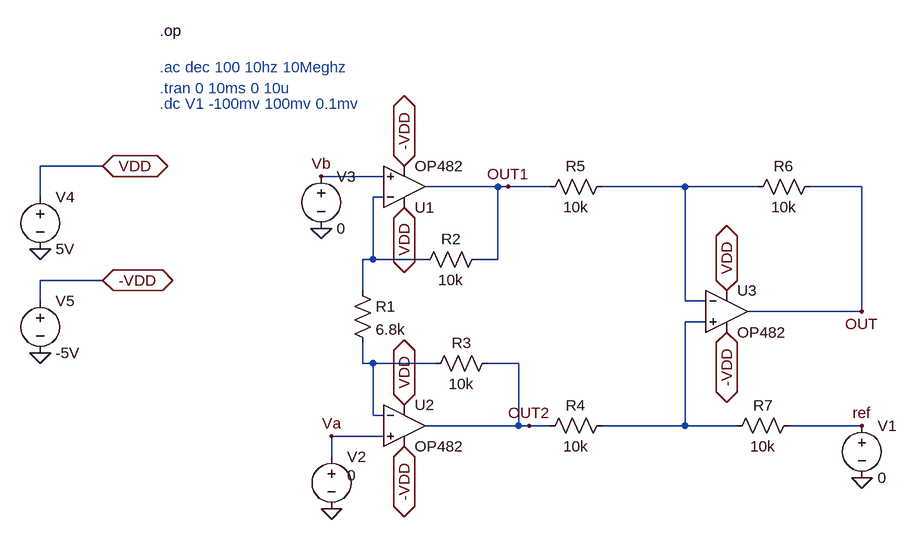
[diagram p0: schematic Draft1.asc]
Draft1.asc, the LTspice schematic file:
Version 4.1
SHEET 1 1096 680
WIRE -128 16 -224 16
WIRE 304 32 208 32
WIRE 480 48 368 48
WIRE 496 48 480 48
WIRE 560 48 496 48
WIRE 768 48 640 48
WIRE 880 48 768 48
WIRE 1040 48 960 48
WIRE -224 64 -224 16
WIRE 304 64 288 64
WIRE 288 160 288 64
WIRE 288 160 272 160
WIRE 368 160 288 160
WIRE 480 160 480 48
WIRE 480 160 448 160
WIRE -128 192 -224 192
WIRE 272 208 272 160
WIRE -224 224 -224 192
WIRE 768 224 768 48
WIRE 800 224 768 224
WIRE 1040 240 1040 48
WIRE 1040 240 864 240
WIRE 800 256 768 256
WIRE 272 320 272 288
WIRE 288 320 272 320
WIRE 384 320 288 320
WIRE 512 320 464 320
WIRE 288 400 288 320
WIRE 304 400 288 400
WIRE 512 416 512 320
WIRE 512 416 368 416
WIRE 528 416 512 416
WIRE 560 416 528 416
WIRE 768 416 768 256
WIRE 768 416 640 416
WIRE 848 416 768 416
WIRE 1040 416 928 416
WIRE 304 432 224 432
WIRE 224 464 224 432
FLAG 208 112 0
FLAG 224 544 0
FLAG -224 144 0
FLAG -224 304 0
FLAG -128 16 VDD
IOPIN -128 16 BiDir
FLAG 336 80 VDD
IOPIN 336 80 BiDir
FLAG 336 384 VDD
IOPIN 336 384 BiDir
FLAG 832 208 VDD
IOPIN 832 208 BiDir
FLAG -128 192 -VDD
IOPIN -128 192 BiDir
FLAG 336 448 -VDD
IOPIN 336 448 BiDir
FLAG 832 272 -VDD
IOPIN 832 272 BiDir
FLAG 336 16 -VDD
IOPIN 336 16 BiDir
FLAG 1040 496 0
FLAG 1040 240 OUT
FLAG 224 432 Va
FLAG 208 32 Vb
FLAG 496 48 OUT1
FLAG 528 416 OUT2
FLAG 1040 416 ref
SYMBOL OpAmps\\OP482 336 112 M180
SYMATTR InstName U1
SYMBOL OpAmps\\OP482 336 352 R0
SYMATTR InstName U2
SYMBOL OpAmps\\OP482 832 176 R0
SYMATTR InstName U3
SYMBOL res 256 192 R0
SYMATTR InstName R1
SYMATTR Value 6.8k
SYMBOL res 464 144 R90
WINDOW 0 0 56 VBottom 2
WINDOW 3 32 56 VTop 2
SYMATTR InstName R2
SYMATTR Value 10k
SYMBOL res 480 304 R90
WINDOW 0 0 56 VBottom 2
WINDOW 3 32 56 VTop 2
SYMATTR InstName R3
SYMATTR Value 10k
SYMBOL res 656 400 R90
WINDOW 0 0 56 VBottom 2
WINDOW 3 32 56 VTop 2
SYMATTR InstName R4
SYMATTR Value 10k
SYMBOL res 656 32 R90
WINDOW 0 0 56 VBottom 2
WINDOW 3 32 56 VTop 2
SYMATTR InstName R5
SYMATTR Value 10k
SYMBOL res 976 32 R90
WINDOW 0 0 56 VBottom 2
WINDOW 3 32 56 VTop 2
SYMATTR InstName R6
SYMATTR Value 10k
SYMBOL res 944 400 R90
WINDOW 0 0 56 VBottom 2
WINDOW 3 32 56 VTop 2
SYMATTR InstName R7
SYMATTR Value 10k
SYMBOL voltage 1040 400 R0
SYMATTR InstName V1
SYMATTR Value 0
SYMBOL voltage 224 448 R0
WINDOW 123 24 72 Left 2
WINDOW 39 0 0 Left 0
WINDOW 3 24 44 Left 2
SYMATTR Value 0
SYMATTR InstName V2
SYMBOL voltage 208 16 R0
SYMATTR InstName V3
SYMATTR Value 0
SYMBOL voltage -224 48 R0
SYMATTR InstName V4
SYMATTR Value 5V
SYMBOL voltage -224 208 R0
SYMATTR InstName V5
SYMATTR Value -5V
TEXT -40 -104 Left 2 ;.tran 0 10ms 0 10u
TEXT -40 -192 Left 2 !.op
TEXT -40 -136 Left 2 ;.ac dec 100 10hz 10Meghz
TEXT -40 -80 Left 2 ;.dc V1 -100mv 100mv 0.1mv

The netlist it stands for:
* Draft1.asc
X§U1 Vb N002 VDD -VDD OUT1 OP482  ; pins In+ In- V+ V- OUT
X§U2 Va N004 VDD -VDD OUT2 OP482  ; pins In+ In- V+ V- OUT
X§U3 N003 N001 VDD -VDD OUT OP482  ; pins In+ In- V+ V- OUT
R1 N002 N004 6.8k
R2 OUT1 N002 10k
R3 OUT2 N004 10k
R4 N003 OUT2 10k
R5 N001 OUT1 10k
R6 OUT N001 10k
R7 ref N003 10k
V1 ref 0 0
V2 Va 0 0
V3 Vb 0 0
V4 VDD 0 5V
V5 -VDD 0 -5V
* .tran 0 10ms 0 10u
.op
* .ac dec 100 10hz 10Meghz
* .dc V1 -100mv 100mv 0.1mv
.backanno
.end